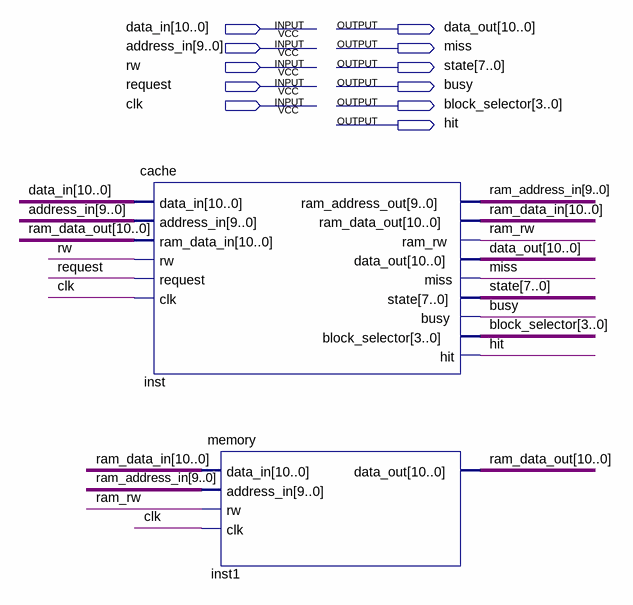
[diagram p0: schematic sheet]
// Quartus schematic main.bdf as structural Verilog: 2 symbols, 11 pins
module main (
  input  [10:0] data_in,
  input  [9:0] address_in,
  input  rw,
  input  request,
  input  clk,
  output [10:0] data_out,
  output miss,
  output [7:0] state,
  output busy,
  output [3:0] block_selector,
  output hit
);

  wire ram_rw;
  wire [9:0] ram_address_in;
  wire [10:0] ram_data_in, ram_data_out;

  cache inst (
    .data_in(data_in), .address_in(address_in), .ram_data_in(ram_data_out), .rw(rw), .request(request),
    .clk(clk), .ram_address_out(ram_address_in), .ram_data_out(ram_data_in), .ram_rw(ram_rw),
    .data_out(data_out), .miss(miss), .state(state), .busy(busy), .block_selector(block_selector), .hit(hit));
  memory inst1 (.data_in(ram_data_in), .address_in(ram_address_in), .rw(ram_rw), .clk(clk), .data_out(ram_data_out));
endmodule
